# EAGLE design BlinkyBoard_NickBluhm_RevB (EAGLE 9.0.1)
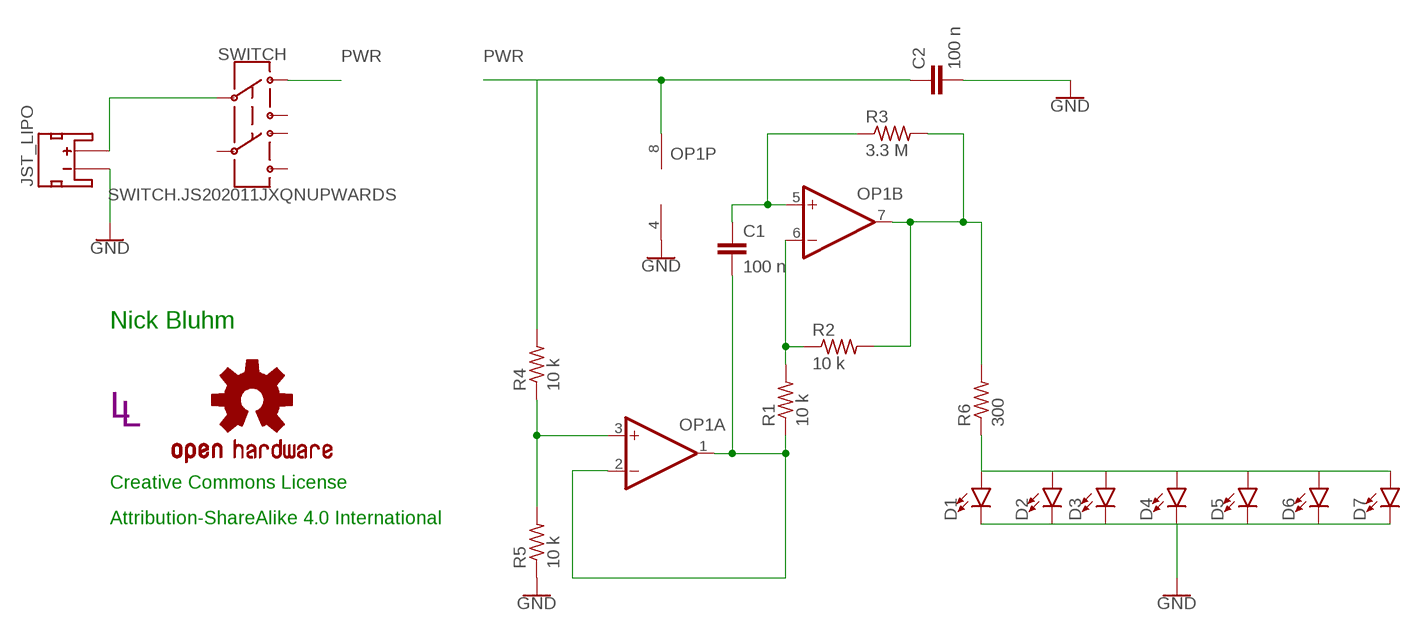
[diagram p0: schematic, sheet 1]

## Parts
C1  100 n  CAPACITOR0402  [C0402]
C2  100 n  CAPACITOR0402  [C0402]
D1  LED0603  [LED-0603]
D2  LED0603  [LED-0603]
D3  LED0603  [LED-0603]
D4  LED0603  [LED-0603]
D5  LED0603  [LED-0603]
D6  LED0603  [LED-0603]
D7  LED0603  [LED-0603]
JST_LIPO  3.7 V  JST_2MM_MALE  [JST-2-SMD]
LOGO1  OSHW-LOGOL-COPPER  [OSHW-LOGO-L_COPPER]
OP1  OP-DUALRM  [MSOP08]
R1  10 k  RESISTOR0402  [R0402]
R2  10 k  RESISTOR0402  [R0402]
R3  3.3 M  RESISTOR0402  [R0402]
R4  10 k  RESISTOR0402  [R0402]
R5  10 k  RESISTOR0402  [R0402]
R6  300  RESISTOR0402  [R0402]
SWITCH  SWITCH.JS202011JXQNUPWARDS  [SWITCH.00]
U$5  LINNES.LAB.LOGO  [LINNES.LAB.LOGO]

## Nets
GND: C2.2 D1.C D7.C JST_LIPO.1(-) OP1.4(P:V-) R5.1
N$1: JST_LIPO.2(+) SWITCH.2
N$3: OP1.3(A:+IN) R4.1 R5.2
N$4: C1.2 OP1.1(A:OUT) OP1.2(A:-IN) R1.1
N$5: OP1.6(B:-IN) R1.2 R2.1
N$6: C1.1 OP1.5(B:+IN) R3.1
N$7: OP1.7(B:OUT) R2.2 R3.2 R6.2
N$8: D1.A D7.A R6.1
PWR: C2.1 OP1.8(P:V+) R4.2 SWITCH.1
Unconnected: D2.A D2.C D3.A D3.C D4.A D4.C D5.A D5.C D6.A D6.C JST_LIPO.NC1(PAD1) JST_LIPO.NC2(PAD2) SWITCH.3 SWITCH.5 SWITCH.6 SWITCH.7

## Notes on the sheet
- Nick Bluhm
- Creative Commons License
- Attribution-ShareAlike 4.0 International

## Library data of the parts
C1 C2 = CalvEngIO-Passives:CAPACITOR
D1-D7 = CalvEngIO-LED:LED: LED (Generic) Standard schematic elements and footprints for 5mm, 3mm, 1206, and 0603 sized LEDs. Generic LEDs with no color specified. LTST-C190KGKT: arrow indicates cathode
JST_LIPO = CalvEngIO-Connectors:JST_2MM_MALE: JST 2MM MALE RA CONNECTOR Two pin, compact surface mount connector. Commonly used as a battery input connection point. We really like the solid locking feeling and high current rating on these small connectors. We use these all the time as battery connectors. Mates to single-cell LiPo batteries. Here is the connector we sell at SparkFun: JST Right Angle Connector - White <https://www.sparkfun.com/products/8612> (PRT-08612) Datasheet <http://www.sparkfun.com/datasheets/Prototyping/Connectors/JST-Horizontal.pdf> It was used on these SparkFun products: SparkFun MOSFET Power Controller <https://www.sparkfun.com/products/11214> (PRT-11214) SparkFun Battery Babysitter - LiPo Battery Manager <https://www.sparkfun.com/products/13777> (PRT-13777) And many, many others that required a lipo battery connection.; PROD_ID: CONN-11443; SF_ID: PRT-08612
LOGO1 = CalvEngIO-Logos:OSHW-LOGO: Open-Source Hardware (OSHW) Logo This logo indicates the piece of hardware it is found on incorporates a OSHW license and/or adheres to the definition of open source hardware found here: http://freedomdefined.org/OSHW
OP1 = CalvEngIO-AnalogIC:OP-DUAL: Precision Micropower, Low Noise CMOS, Rail-to-Rail Input/Output Operational Amplifiers Source: http://www.analog.com/static/imported-files/data_sheets/AD8603_8607_8609.pdf; MF: ALTERA CORPORATION; MPN: AD8607ARMZ-REEL; OC_FARNELL: 1464990; OC_NEWARK: 59K6925
R1-R6 = CalvEngIO-Passives:RESISTOR
SWITCH = CalvEngIO-Switches:SWITCH.JS202011JXQN: Manufacturer's Part Numer: JS202011JAQN for right angle throw JS202011JCQN for top side throw
U$5 = CalvEngIO-Logos:LINNES.LAB.LOGO

## Board
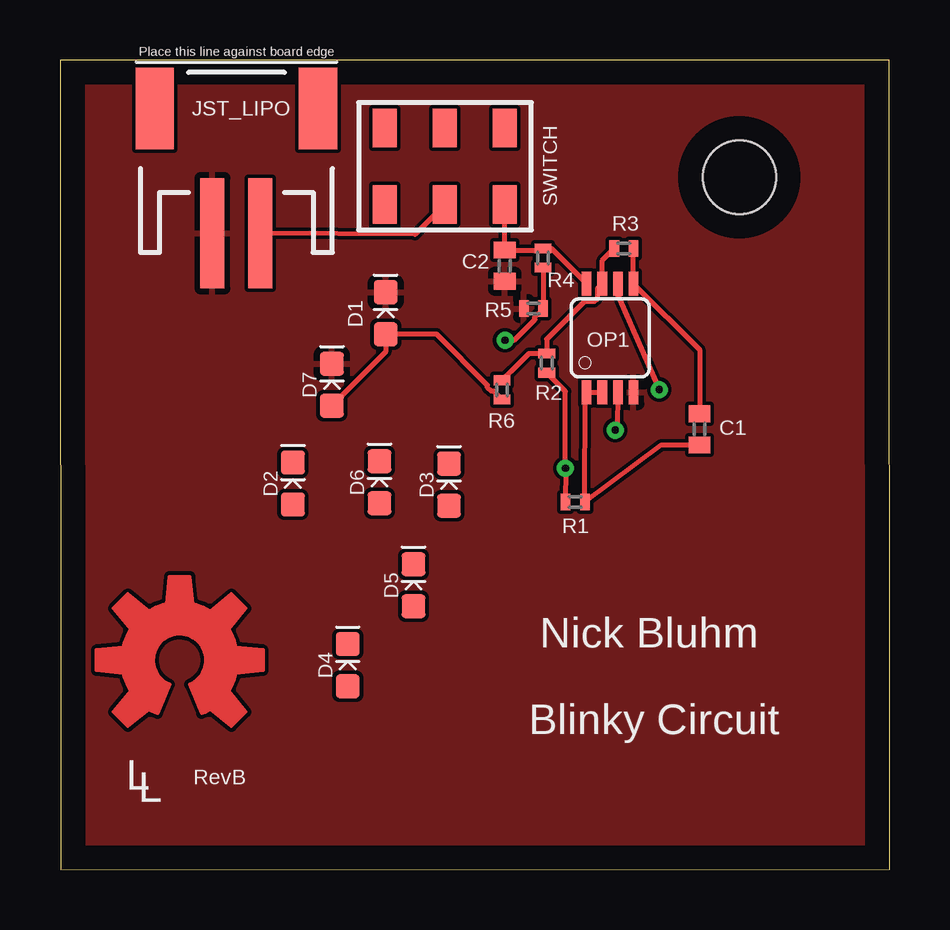
[diagram p1: board, top side]
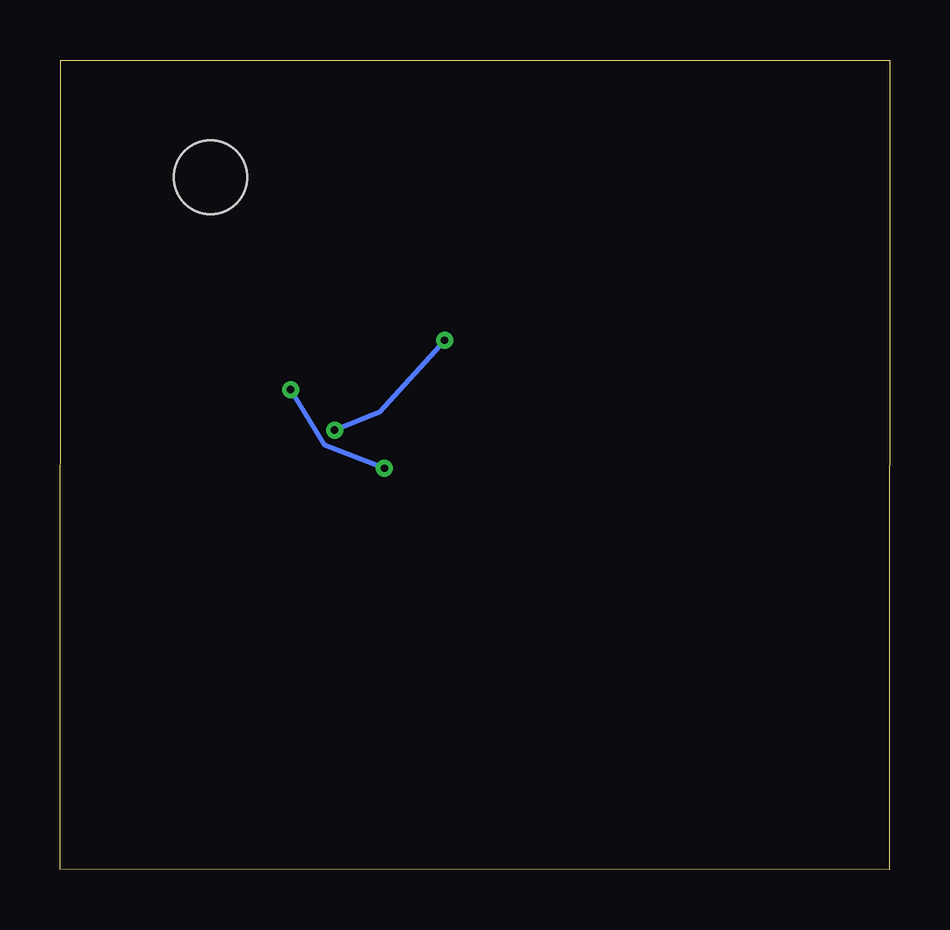
[diagram p2: board, bottom side, seen from below]

Size 34.57 x 33.75 mm. Coordinates in mm from the lower left corner, seen from the top.
Outline: 0.03,0 34.57,0.03 34.55,33.75 0,33.75 0.03,0
Copper layers (1*16): Top 0.035mm / dielectric 1.5mm / Bottom 0.035mm
Design rules "default": minimum track width 6mil, minimum drill 0.35mm, track to track 6mil, track to pad 6mil, pad to pad 6mil, via to via 6mil, smd to smd 6mil, copper to edge 40mil, drill to drill 6mil, minimum pad ring 10mil, minimum via ring 8mil, stop-mask expansion 4mil, vias tented up to drill 0mil, thermal gap 10mil
Holes 3.05 mm at 28.31,28.86

### Footprints (pad centres in the part's own frame; a part is rotated, then mirrored left to right if it is on the bottom)
C0402 = smd 0.7 x 0.9: 1 -0.65,0; 2 0.65,0
LED-0603 = smd 1 x 1: A -0.877,0; C 0.877,0
JST-2-SMD = smd 1 x 4.6: 1 -1,-3.7; 2 1,-3.7 | smd 1.6 x 3.4: NC1 -3.4,1.5; NC2 3.4,1.5
MSOP08 = smd 0.4 x 1: 1 -0.976,-2.263; 2 -0.326,-2.263; 3 0.324,-2.263; 4 0.974,-2.263; 5 0.974,2.262; 6 0.324,2.262; 7 -0.326,2.262; 8 -0.976,2.262
R0402 = smd 0.4 x 0.7: 1 -0.4,0; 2 0.4,0
SWITCH.00 = smd 1 x 1.6: 1 -2.5,1.6; 2 0,1.6; 3 2.5,1.6; 5 -2.5,-1.6; 6 0,-1.6; 7 2.5,-1.6

### Placement (x,y rotation side)
C1  26.65,18.36 270 top
C2  18.53,25.18 270 top
D1  13.57,23.2 90 top
D2  9.7,16.1 90 top
D3  16.21,16.05 90 top
D4  11.99,8.53 90 top
D5  14.73,11.86 90 top
D6  13.31,16.15 90 top
D7  11.33,20.22 90 top
JST_LIPO  7.35,30.23 0 top
LOGO1  4.98,8.75 0 top
OP1  22.92,22.17 0 top
R1  21.47,15.33 180 top
R2  20.28,21.12 90 top
R3  23.49,25.9 180 top
R4  20.13,25.5 90 top
R5  19.73,23.39 0 top
R6  18.42,20 90 top
SWITCH  16.04,29.32 180 top
U$5  2.75,3.33 0 top

### Tracks (layer width: path | path; a pad name or v marks a point on that pad's centre or on a via)
GND
  pour Top: -2.97,42 37.23,35.4 51.03,-3 -3.97,-3 -3.97,41
N$1
  Top 0.203: SWITCH.2 14.8,26.48 JST_LIPO.2
N$3  (via drill 0.3 pad 0.12)
  Top 0.203: OP1.3 23.22,18.41 v23.13,18.32 | R4.1 R5.2 | R5.2 | R5.2 19.78,23.05 19.78,22.93 18.92,22.07 v18.55,22.07
  Bottom 0.203: v18.55,22.07 21.28,19.06 v23.13,18.32
N$4
  Top 0.152: 21.97,19.88 OP1.1
  Top 0.203: OP1.1 OP1.2 | C1.2 25.06,17.71 R1.1 21.89,19.8 21.97,19.88
N$5  (via drill 0.3 pad 0.12)
  Top 0.203: v24.97,20.01 23.24,23.95 OP1.6 | R1.2 21.09,16.7 v21.06,16.74 21.06,19.94 R2.1
  Bottom 0.203: v24.97,20.01 23.54,17.7 v21.06,16.74
N$6
  Top 0.203: R3.1 OP1.5 26.65,21.68 C1.1 | R3.1
N$7
  Top 0.203: R3.2 22.59,25.4 OP1.7 22.4,24.24 22.4,23.83 22.25,23.68 21.84,23.68 20.28,22.12 R2.2 19.53,21.52 18.78,20.76 R6.2
N$8
  Top 0.203: R6.1 18.07,19.95 17.96,19.95 17.81,20.1 17.81,20.21 15.7,22.32 D1.A 13.57,21.58 D7.A
PWR
  Top 0.203: SWITCH.1 18.54,25.84 C2.1 20.06,25.83 R4.2 20.47,25.9 OP1.8

### Text on the board
tNames: Nick Bluhm | Blinky Circuit | RevB